# EAGLE design 261003902xxxx-HW-V1.3 (EAGLE 7.7.0)
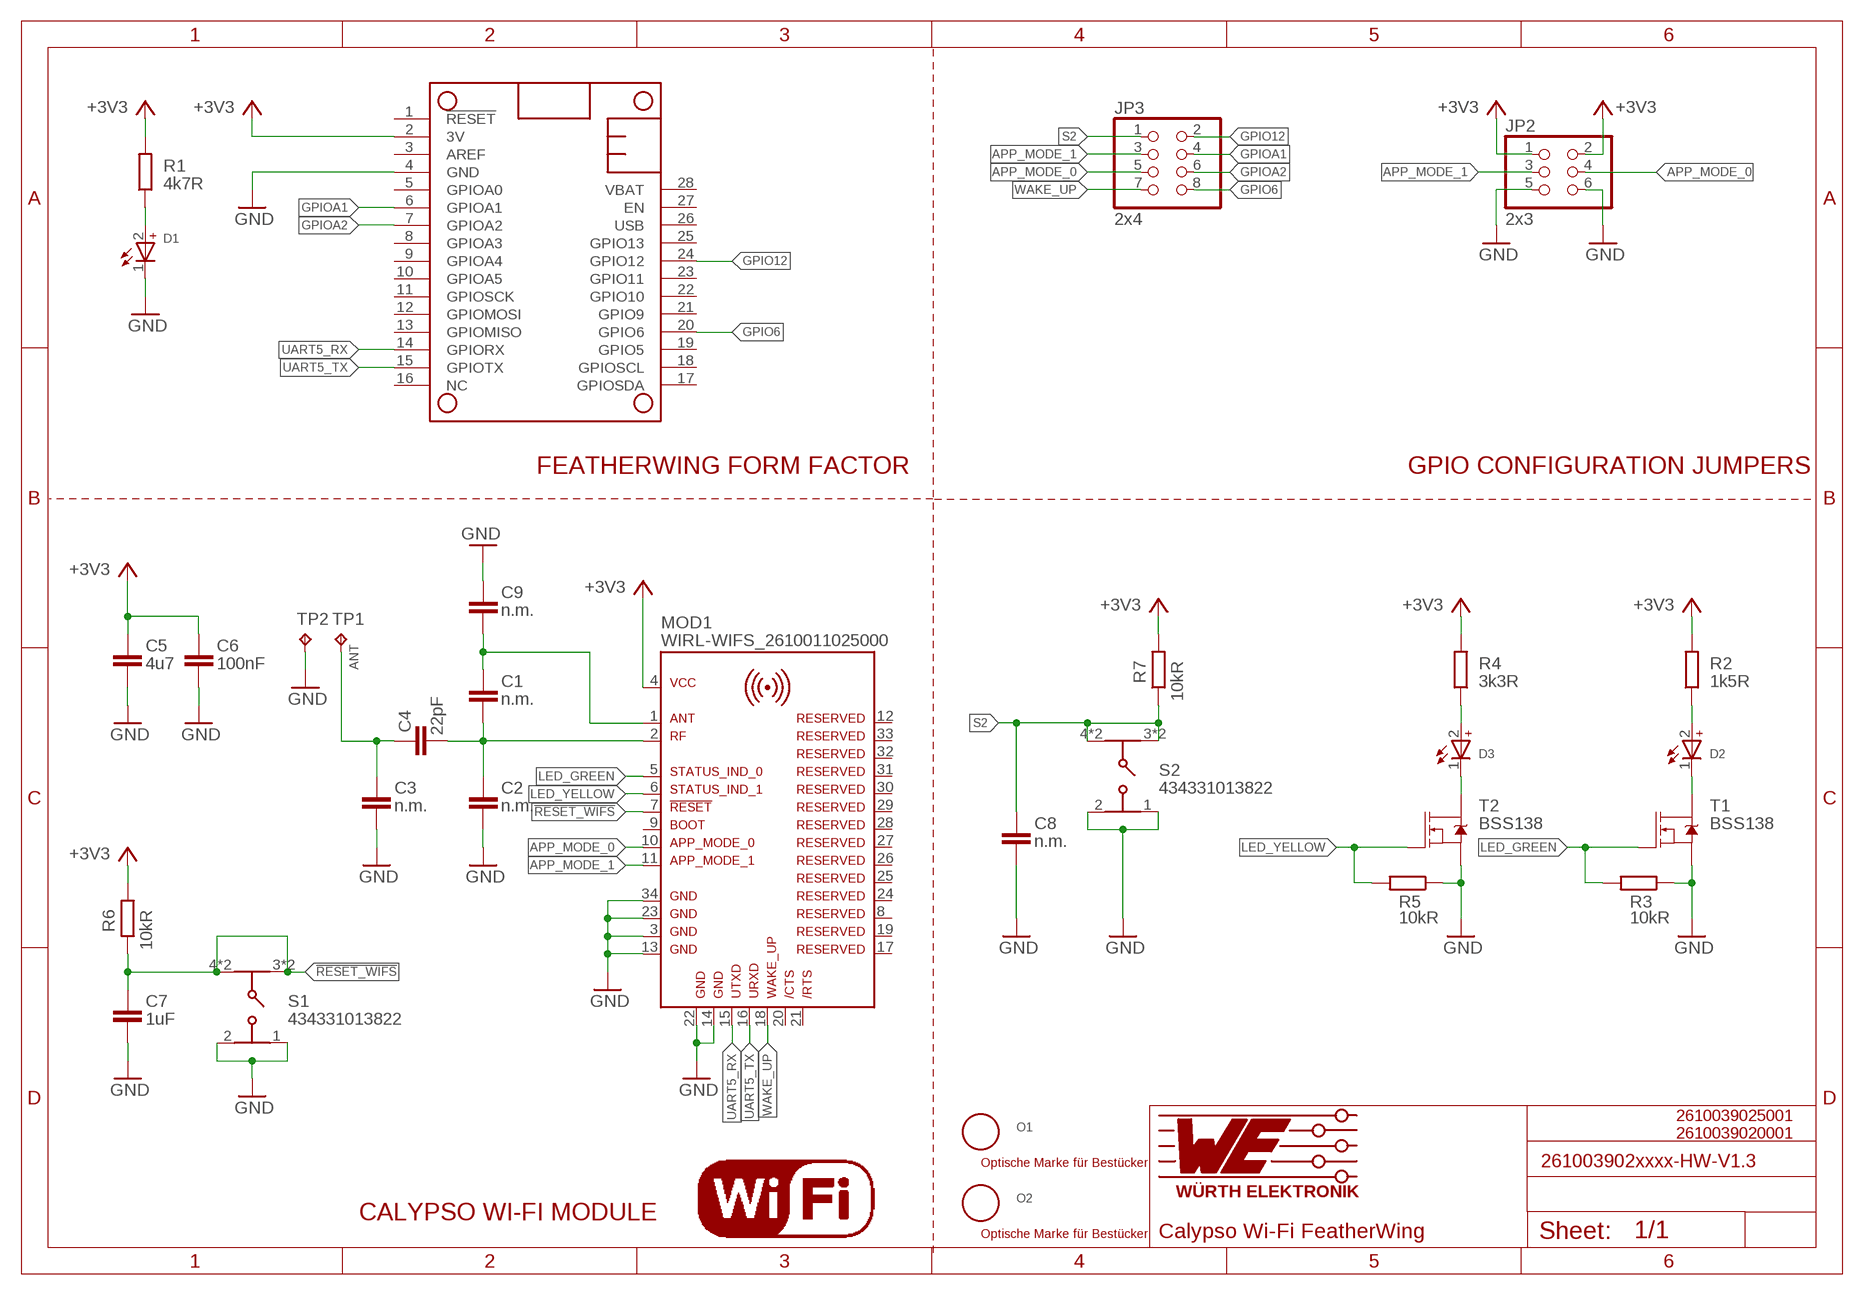
[diagram p0: schematic, sheet 1]

## Parts
C1  n.m.  C0402_IPC  [C0402_IPC]
C2  n.m.  C0201_IPC  [C0201_IPC]
C3  n.m.  C0201_IPC  [C0201_IPC]
C4  22pF  C22PF0402_IPC  [C0402_IPC]
C5  4u7  C4.7UF0402_IPC  [C0402_IPC]
C6  100nF  C100NF0402_IPC  [C0402_IPC]
C7  1uF  C1UF0402_IPC  [C0402_IPC]
C8  n.m.  C0402_IPC  [C0402_IPC]
C9  n.m.  C0201_IPC  [C0201_IPC]
D1  RED  WL-SMSW_1204_155124RS73200  [WL-SMSW_1204_A]
D2  GREEN  WL-SMSW_1204_155124VS73200  [WL-SMSW_1204_A]
D3  YELLOW  WL-SMSW_1204_155124YS73200  [WL-SMSW_1204_A]
JP2  2x3  PINHD-2X3  [2X03]
JP3  2x4  PINHD-2X4  [2X04]
MOD1  WIRL-WIFS_2610011025000  [WIRL-WIFS_2610011025000]
MS1  header: 1 x 12 & 1 x 16  FEATHERWING_80MM  [FEATHERWING_80MM]
O1  n.m.  OPT_MARKE  [OPTISCHE_MARKE]
O2  n.m.  OPT_MARKE  [OPTISCHE_MARKE]
R1  4k7R  R4K70402_IPC  [R0402_IPC]
R2  1k5R  R1K5R0402_IPC  [R0402_IPC]
R3  10kR  R10KR0402_IPC  [R0402_IPC]
R4  3k3R  R3K3R0402_IPC  [R0402_IPC]
R5  10kR  R10KR0402_IPC  [R0402_IPC]
R6  10kR  R10KR0402_IPC  [R0402_IPC]
R7  10kR  R10KR0402_IPC  [R0402_IPC]
S1  434331013822  [434331013822]
S2  434331013822  [434331013822]
T1  BSS138  MOSFET-NCH-BSS138  [SOT23-3]
T2  BSS138  MOSFET-NCH-BSS138  [SOT23-3]
TP1  n.m.  TP-DRILL0.6  [D0.6]
TP2  n.m.  TP-DRILL0.6  [D0.6]
U$1  WIFI5MM  [WIFI_5MM]

## Nets
!RESET_WIFS: C7.1 MOD1.7 R6.1 S1.3 S1.4 S1.5 S1.6
+3V3 [V]: C5.1 C6.1 JP2.1 JP2.2 MOD1.4 MS1.2(3V) R1.2 R2.2 R4.2 R6.2 R7.2
ANT: C3.P$1 C4.1 TP1.P$1(TP)
APP_MODE_0: JP2.4 JP3.5 MOD1.10
APP_MODE_1: JP2.3 JP3.3 MOD1.11
GND: C2.P$2 C3.P$2 C5.2 C6.2 C7.2 C8.2 C9.P$2 D1.1(-) JP2.5 JP2.6 MOD1.3 MOD1.13 MOD1.14 MOD1.22 MOD1.23 MOD1.34 MS1.4(GND) R3.1 R5.1 S1.1 S1.2 S2.1 S2.2 T1.2(S) T2.2(S) TP2.P$1(TP)
GPIO6: JP3.8 MS1.20(GPIO6)
GPIO12: JP3.2 MS1.24(GPIO12)
GPIOA1: JP3.4 MS1.6(GPIOA1)
GPIOA2: JP3.6 MS1.7(GPIOA2)
LED_GREEN: MOD1.5 R3.2 T1.1(G)
LED_YELLOW: MOD1.6 R5.2 T2.1(G)
N$1: D1.2(+) R1.1
N$2: C1.1 C2.P$1 C4.2 MOD1.2
N$3: C1.2 C9.P$1 MOD1.1
N$5: D2.2(+) R2.1
N$6: D2.1(-) T1.3(D)
N$8: D3.2(+) R4.1
N$9: D3.1(-) T2.3(D)
S2: C8.1 JP3.1 R7.1 S2.3 S2.4 S2.5 S2.6
UART5_RX: MOD1.15 MS1.14(GPIORX)
UART5_TX: MOD1.16 MS1.15(GPIOTX)
WAKE_UP: JP3.7 MOD1.18
Unconnected: MOD1.8 MOD1.9 MOD1.12 MOD1.17 MOD1.19 MOD1.20 MOD1.21 MOD1.24 MOD1.25 MOD1.26 MOD1.27 MOD1.28 MOD1.29 MOD1.30 MOD1.31 MOD1.32 MOD1.33 MS1.1(!RESET) MS1.3(AREF) MS1.5(GPIOA0) MS1.8(GPIOA3) MS1.9(GPIOA4) MS1.10(GPIOA5) MS1.11(GPIOSCK) MS1.12(GPIOMOSI) MS1.13(GPIOMISO) MS1.16(NC) MS1.17(GPIOSDA) MS1.18(GPIOSCL) MS1.19(GPIO5) MS1.21(GPIO9) MS1.22(GPIO10) MS1.23(GPIO11) MS1.25(GPIO13) MS1.26(USB) MS1.27(EN) MS1.28(VBAT)

## Notes on the sheet
- FEATHERWING FORM FACTOR | GPIO CONFIGURATION JUMPERS
- 2610039025001
  2610039020001
- CALYPSO WI-FI MODULE
- Calypso Wi-Fi FeatherWing

## Library data of the parts
C1 C8 = rcl-amber:C; HEIGHT: 0.5mm; PACK: 0402
C2 C3 C9 = rcl-amber:C; HEIGHT: 0.3mm; PACK: 0201
C4 = rcl-WE:C; HEIGHT: 0.5mm; MANUFACTURER: Würth Elektronik; MAT: NP0; NR: 885012005057; PACK: 0402; SPG: 50V; TOL: 5%
C5 = rcl-WE:C; HEIGHT: 0.5mm; MANUFACTURER: Würth Elektronik; MAT: X5R; NR: 885012105008; PACK: 0402; SPG: 6.3V; TOL: 20%
C6 = rcl-WE:C; HEIGHT: 0.5mm; MANUFACTURER: Würth Elektronik; MAT: X7R; NR: 885012205037; PACK: 0402; SPG: 16V; TOL: 10%
C7 = rcl-WE:C; HEIGHT: 0.5mm; MANUFACTURER: Würth Elektronik; MAT: X5R; NR: 885012105012; PACK: 0402; SPG: 10V; TOL: 20%
D1 = 155124YS73200A_Eagle_WL-SMSW_rev20a:WL-SMSW_1204: WL-SMSW SMT Mono-color Side View Waterclear Characteristics High reliability Low current requirement No UV/IR radiation Wide viewing angle Excelllent for edge lighting LED displays and backlighting indicators Ideal for miniature applications Compatible with automatic placement equipment Applications Backlighting for LCD Sidelighting applications Indicator and backlighting for telecommunication Backlighting for symbols, switches and dashboards General LED lighting <https://www.we-online.com/catalog/media/o35735v209%20Family_WL-SMSW_1204_155124xx73200A.jpg> Details see: https://www.we-online.com/catalog/en/WL-SMSW/; HEIGHT: 1.5mm; MANUFACTURER: Würth Elektronik; NR: 155124RS73200; PACK: 1204
D2 = 155124YS73200A_Eagle_WL-SMSW_rev20a:WL-SMSW_1204: WL-SMSW SMT Mono-color Side View Waterclear Characteristics High reliability Low current requirement No UV/IR radiation Wide viewing angle Excelllent for edge lighting LED displays and backlighting indicators Ideal for miniature applications Compatible with automatic placement equipment Applications Backlighting for LCD Sidelighting applications Indicator and backlighting for telecommunication Backlighting for symbols, switches and dashboards General LED lighting <https://www.we-online.com/catalog/media/o35735v209%20Family_WL-SMSW_1204_155124xx73200A.jpg> Details see: https://www.we-online.com/catalog/en/WL-SMSW/; HEIGHT: 1.5mm; MANUFACTURER: Würth Elektronik; NR: 155124VS73200; PACK: 1204
D3 = 155124YS73200A_Eagle_WL-SMSW_rev20a:WL-SMSW_1204: WL-SMSW SMT Mono-color Side View Waterclear Characteristics High reliability Low current requirement No UV/IR radiation Wide viewing angle Excelllent for edge lighting LED displays and backlighting indicators Ideal for miniature applications Compatible with automatic placement equipment Applications Backlighting for LCD Sidelighting applications Indicator and backlighting for telecommunication Backlighting for symbols, switches and dashboards General LED lighting <https://www.we-online.com/catalog/media/o35735v209%20Family_WL-SMSW_1204_155124xx73200A.jpg> Details see: https://www.we-online.com/catalog/en/WL-SMSW/; HEIGHT: 1.5mm; MANUFACTURER: Würth Elektronik; NR: 155124YS73200; PACK: 1204
JP2 = pinhead:PINHD-2X3: PIN HEADER; HEIGHT: 8.54mm; MANUFACTURER: Würth Elektronik; NR: 61300621121
JP3 = pinhead:PINHD-2X4: PIN HEADER; HEIGHT: 8.54mm; MANUFACTURER: Würth Elektronik; NR: 61300821121
MOD1 = WE_WIRL_Rev1_mod:WIRL-WIFS_2610011025000: Calypso - Wi-Fi Radio Module WIRL-WIFS Calypso WIFI module T&R Details see: https://katalog.we-online.com/en/wco/Calypso Created By Ella Wu 2019-03-28 2019 (C) Wurth Elektronik; HEIGHT: 3.0mm; MANUFACTURER: Würth Elektronik; NR: 2610011025000
MS1 = adafruit_feather_long:FEATHERWING; COMMENT: Kit containing 2 headers; MANUFACTURER: Adafruit; NR: 2830
O1 O2 = testpad:OPT_MARKE: Gemäß Vorgabe MEC
R1 = rcl-amber:R; HEIGHT: 0.35mm; MANUFACTURER: Yageo; NR: RC0402FR-074K7L; P: 0.063W; PACK: 0402; TOL: 1%
R2 = rcl-amber:R; HEIGHT: 0.35mm; MANUFACTURER: Yageo; NR: RC0402FR-071K5L; PACK: 0402; TOL: 1%
R3 R5-R7 = rcl-amber:R; HEIGHT: 0.35mm; MANUFACTURER: Yageo; NR: RC0402FR-0710KL; PACK: 0402; TOL: 1%
R4 = rcl-amber:R; HEIGHT: 0.35; MANUFACTURER: Yageo; NR: RC0402FR-073K3L; P: 0.063W; PACK: 0402; TOL: 1%
S1 S2 = 434331013822_Eagle_WS-TASU_rev19b:434331013822: WS-TASU Side push Tact Switch, SMD version Specification Rating : 50mA, 12VDC Contact Resistance Initial: 100mΩ max. After life test:1mΩ max. Insulation Resistance: min.100MΩ at 500VDC Dielectric Strength : 250VAC for 1 minute Stroke:0.2+0.2/-0.1mm Bounce :10ms max. Material Cover : : Stainless steel Stem :PA46 UL HB. FramePA46 UL HB, color Black >Contact : Stainless Steel with Silver Tape:Polyimide tape Terminal : Copper Alloy with Silver <http://katalog.we-online.de/media/images/v2/Family_WS-TASU_434331013822_c.jpg> Details see: http://katalog.we-online.de/en/em/TASU_3_5X2_9_SMD_SIDE_PUSH/434331013822 2015 (C) Würth Elektronik; HEIGHT: 1.35mm; MANUFACTURER: Würth Elektronik; NR: 434331013822
T1 T2 = SparkFun-DiscreteSemi:MOSFET-NCH: N-channel MOSFETs Voltage controlled devices that allow control of high current outputs. SparkFun Products: SparkFun OpenScale <https://www.sparkfun.com/products/13261> SparkFun Digital Sandbox <https://www.sparkfun.com/products/12651> SparkFun Monster Moto Shield <https://www.sparkfun.com/products/10182> SparkFun MOSFET Power Controller <https://www.sparkfun.com/products/11214>; HEIGHT: 1mm; MANUFACTURER: Diodes Incorporated; NR: BSS138-13-F; PACK: SOT23-3; PROD_ID: TRANS-00830; VALUE: 220mA/50V/3.5Ω
TP1 TP2 = testpad:TP-DRILL
U$1 = logo:WIFI

## Net classes
1 V: width 0.3 mm

## Board
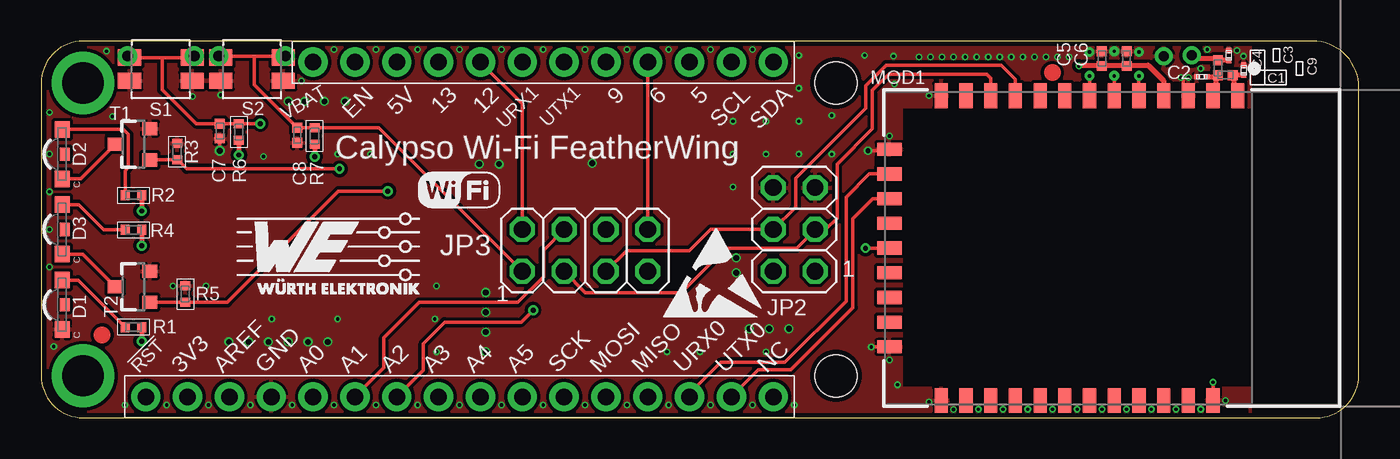
[diagram p1: board, top side]
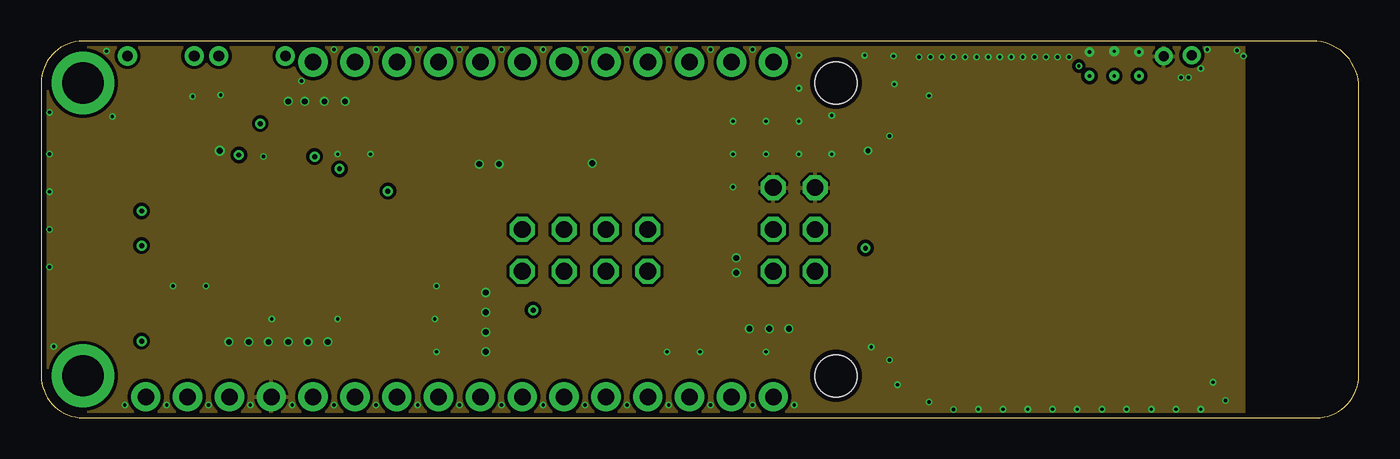
[diagram p2: board, inner layer Route2]
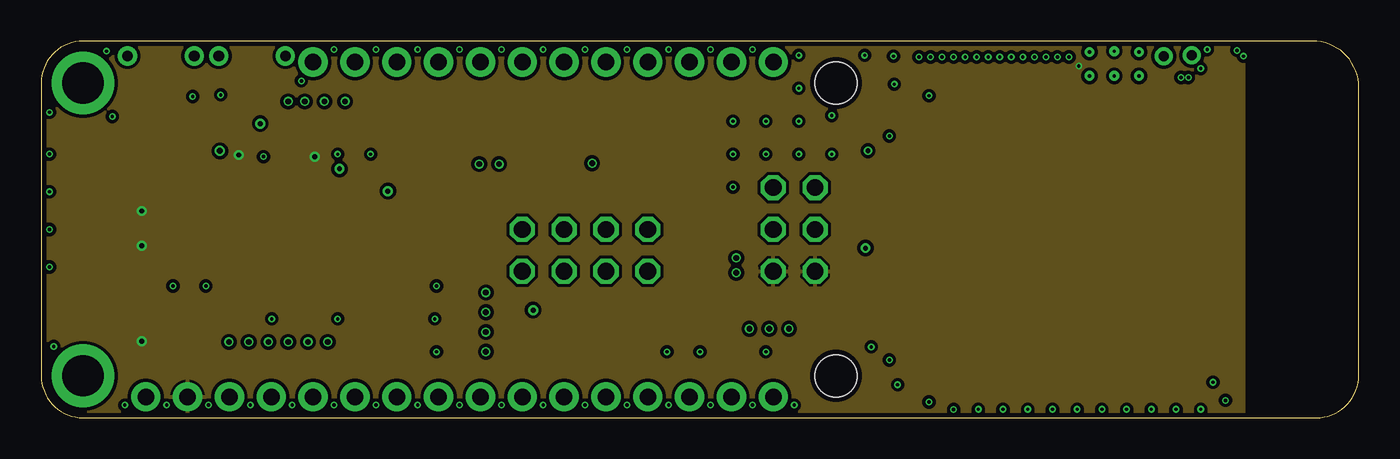
[diagram p3: board, inner layer Route15]
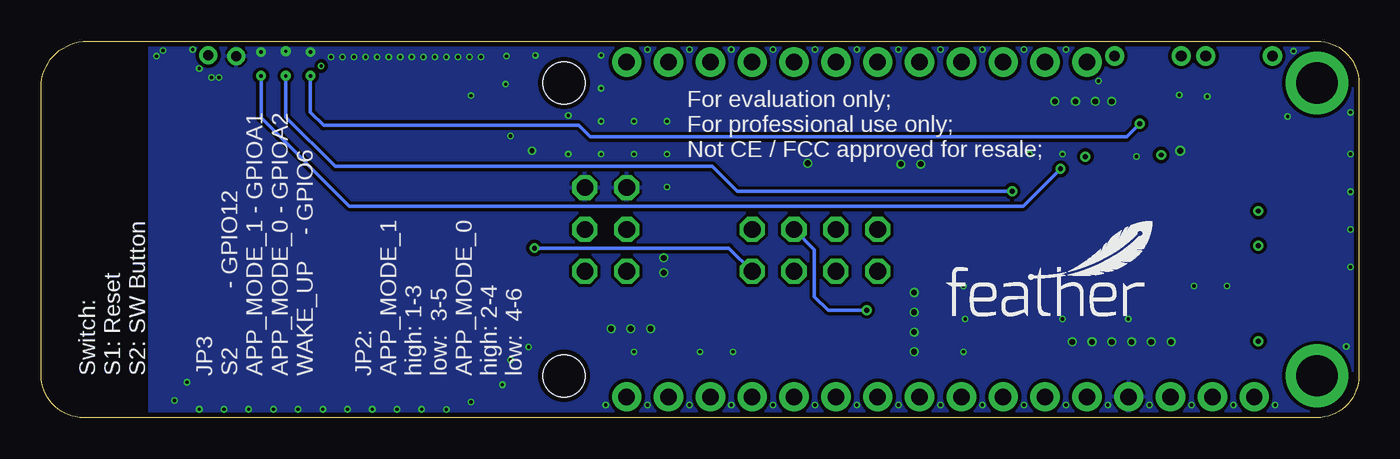
[diagram p4: board, bottom side, seen from below]

Size 80 x 22.86 mm. Coordinates in mm from the lower left corner, seen from the top.
Copper layers (1+2*15+16): Top 0.035mm / dielectric 0.376mm / Route2 0.035mm / dielectric 0.71mm / Route15 0.035mm / dielectric 0.376mm / Bottom 0.035mm
Design rules "default *": minimum track width 0.2mm, minimum drill 0.2mm, track to track 0.2mm, track to pad 0.2mm, pad to pad 0.2mm, via to via 0.2mm, smd to smd 0.2mm, copper to edge 0.3mm, drill to drill 6mil, minimum pad ring 10mil, minimum via ring 0.1mm, stop-mask expansion 0.05mm, vias tented up to drill 20mil, thermal gap 6mil
tRestrict: area 71.7,0.3 to 73.3,0.7; area 70.2,0.8 to 70.7,2; area 70.7,1.8 to 70.9,2.3; area 70.8,2.4 to 71.5,2.6; area 71.4,1.8 to 71.7,2.4; area 52.3,1.9 to 73.4,18.8; area 68.6,18.8 to 69.2,20.4; area 70.1,18.8 to 70.7,20.3; area 50.6,15.2 to 52.2,15.9; area 55.1,18.8 to 55.7,20.5; area 59.6,20.4 to 63.2,20.4; area 64.1,20.3 to 64.7,20.4; area 65.7,20.3 to 66.2,20.4; area 68.7,0.8 to 69.2,2; area 67.2,0.8 to 67.7,2; area 65.7,0.8 to 66.2,2; area 64.2,0.8 to 64.7,2; area 62.6,0.8 to 63.1,2; area 61.1,0.8 to 61.6,2; area 59.6,0.8 to 60.1,2; area 58.1,0.8 to 58.6,2; area 56.6,0.8 to 57.1,2; area 55.1,0.8 to 55.6,2

### Footprints (pad centres in the part's own frame; a part is rotated, then mirrored left to right if it is on the bottom)
C0402_IPC = smd 0.6 x 0.6: 1 -0.45,0; 2 0.45,0
C0201_IPC = smd 0.35 x 0.3: P$1 -0.3,0; P$2 0.3,0
WL-SMSW_1204_A = smd 1 x 0.9: 1 -1.5,0; 2 1.5,0 | smd 0.8 x 0.6: 3 0,-0.15
2X03 = drill 1.016 octagon: 1 -2.54,-1.27; 2 -2.54,1.27; 3 0,-1.27; 4 0,1.27; 5 2.54,-1.27; 6 2.54,1.27
2X04 = drill 1.016 octagon: 1 -3.81,-1.27; 2 -3.81,1.27; 3 -1.27,-1.27; 4 -1.27,1.27; 5 1.27,-1.27; 6 1.27,1.27; 7 3.81,-1.27; 8 3.81,1.27
WIRL-WIFS_2610011025000 = smd 0.8 x 1.5: 1 -7.65,-9.25; 2 -6.15,-9.25; 3 -4.65,-9.25; 4 -3.15,-9.25; 5 -1.65,-9.25; 6 -0.15,-9.25; 7 1.35,-9.25; 8 2.85,-9.25; 9 4.35,-9.25; 10 5.85,-9.25; 11 7.35,-9.25; 12 8.85,-9.25; 13 10.35,-9.25; 23 10.35,9.25; 24 8.85,9.25; 25 7.35,9.25; 26 5.85,9.25; 27 4.35,9.25; 28 2.85,9.25; 29 1.35,9.25; 30 -0.15,9.25; 31 -1.65,9.25; 32 -3.15,9.25; 33 -4.65,9.25; 34 -6.15,9.25 | smd 1.5 x 0.8: 14 13.5,-6; 15 13.5,-4.5; 16 13.5,-3; 17 13.5,-1.5; 18 13.5,0; 19 13.5,1.5; 20 13.5,3; 21 13.5,4.5; 22 13.5,6
FEATHERWING_80MM = drill 1 pad 1.778: 1 6.35,1.27; 2 8.89,1.27; 3 11.43,1.27; 4 13.97,1.27; 5 16.51,1.27; 6 19.05,1.27; 7 21.59,1.27; 8 24.13,1.27; 9 26.67,1.27; 10 29.21,1.27; 11 31.75,1.27; 12 34.29,1.27; 13 36.83,1.27; 14 39.37,1.27; 15 41.91,1.27; 16 44.45,1.27; 17 44.45,21.59; 18 41.91,21.59; 19 39.37,21.59; 20 36.83,21.59; 21 34.29,21.59; 22 31.75,21.59; 23 29.21,21.59; 24 26.67,21.59; 25 24.13,21.59; 26 21.59,21.59; 27 19.05,21.59; 28 16.51,21.59 | drill 2.5 pad 3.81: P$1 2.54,20.32; P$2 2.54,2.54 | hole 2.54: 48.26,20.32; 48.26,2.54
R0402_IPC = smd 0.55 x 0.6: 1 -0.5,0; 2 0.5,0
434331013822 = smd 1.4 x 1: 1 -1.9,0.7; 2 1.9,0.7; 3 1.9,-0.7; 4 -1.9,-0.7 | drill 0.65 pad 0.78: 5 -2.025,-0.8; 6 2.025,-0.8
SOT23-3 = smd 0.8 x 0.9: 1 -0.95,-1; 2 0.95,-1; 3 0,1.1
D0.6 = drill 0.6: P$1 0,0

### Placement (x,y rotation side)
C1  71.9,20.8 0 top
C2  70.47,20.7 180 top
C3  72.1,22 90 top
C4  71.45,21.25 270 top
C5  64.4,21.8 90 top
C6  65.9,21.8 90 top
C7  10.85,17.4 270 top
C8  15.55,17.15 270 top
C9  73,21.1 90 top
D1  1.27,6.86 90 top
D2  1.27,16 90 top
D3  1.27,11.43 90 top
JP2  45.72,11.43 90 top
JP3  33.02,10.16 0 top
MOD1  65,10.3 180 top
MS1  0,0 0 top
O1  61.4,20.95 0 top
O2  3.7,5.02 0 top
R1  5.6,5.5 0 top
R2  5.6,13.5 0 top
R3  8.25,16.15 270 top
R4  5.6,11.4 0 top
R5  8.75,7.5 270 top
R6  12,17.35 270 top
R7  16.6,17.1 270 top
S1  7.26,21.16 180 top
S2  12.8,21.16 180 top
T1  5.6,16.6 90 top
T2  5.6,7.95 90 top
TP1  69.85,22 0 top
TP2  68.15,21.95 0 top
U$1  22.86,12.7 0 top
U$2  [WE-LOGO-5MM_TNAME]  17.42,9.98 0 top
U$4  [FEATHER_12MM]  25.05,6.15 0 bottom
U$5  [ESD_6MM]  37.7,6.05 0 top

### Tracks (layer width: path | path; a pad name or v marks a point on that pad's centre or on a via)
!RESET_WIFS  (via drill 0.2 pad 0.6, 0.3 pad 0.6)
  Top 0.2: v63.65,20.75 MOD1.7 63.65,19.5 | S1.3 5.34,21.86 S1.6 5.26,21.96 S1.3 | S1.3 7.4,21.86 | 7.4,21.86 S1.4 9.19,21.86 S1.5 | 7.4,21.86 7.35,21.81 7.35,19.9 9.4,17.85 C7.1 R6.1 v13.3,17.85
  Bottom 0.2: v63.65,20.75 63.65,18.55 62.85,17.75 47.35,17.75 46.65,17.05 14.1,17.05 v13.3,17.85
+3V3  (via drill 0.2 pad 0.3, 0.3 pad 0.6)
  Top 0.3: v63,21.35 63.05,21.4 64.35,21.4 C5.1 64.45,21.4 65.85,21.4 C6.1 65.95,21.4 67.2,21.4 68.15,20.45 MOD1.4 | R4.2 v6.1,10.45 | R2.2 v6.1,12.55 | R6.2 v12,15.95 | R1.2 v6.1,4.65 | R7.2 v16.6,15.85
  pour Route15: 0,0 0,22.86 80.01,22.86 80.01,0
ANT
  Top 0.3: C3.P$1 C4.1 71.35,21.8 70.05,21.8 TP1.P$1
APP_MODE_0
  Top 0.2: MOD1.10 59.15,20.55 58.3,21.4 51.3,21.4 50.05,20.15 50.05,18.8 45.8,14.55 45.8,12.78 JP2.4 40.64,11.43 39.36,10.15 35.55,10.15 JP3.5
APP_MODE_1
  Top 0.2: MOD1.11 57.65,20.6 57.4,20.85 51.45,20.85 50.47,19.87 50.47,17.53 48.32,15.38 48.32,12.12 47.63,11.43 JP2.3 45.86,10.3 41.55,10.3 38.85,7.6 33.04,7.6 JP3.3
GND  (via drill 0.2, 0.2 pad 0.2, 0.2 pad 0.4, 0.2 pad 0.6, 0.3, 0.35, 0.35 pad 0.6)
  Top 0.2: C7.2 v10.85,16.2 | v69.2,20.65 69.2,20.6 69.35,20.45 69.35,19.55 MOD1.3 | MOD1.34 v71.15,2.15 | MOD1.14 51.5,16.25 51.45,16.2 v50.2,16.2 | MOD1.22 v50.4,4.3
  other vias: 15,19.2 16,19.2 17.2,19.2 18.45,19.2 26.6,15.4 27.8,15.4 33.45,15.45 43,5.4 44.2,5.4 45.4,5.4 17.4,4.6 16.2,4.6 15,4.6 13.8,4.6 12.6,4.6 11.4,4.6 27,7.6 27,6.4 27,5.2 27,4 42.2,8.8 42.2,9.7 70.4,21.2 69.65,20.65 63.65,22.2 62.4,21.9 61.7,21.9 61,21.9 60.3,21.9 59.6,21.9 58.9,21.9 58.2,21.9 57.5,21.9 56.8,21.9 56.1,21.9 55.4,21.9 54.7,21.9 54,21.9 53.3,21.9 51.75,21.95 53.9,19.55 51.8,20.25 70.8,22.35 73,21.95 72.6,22.3 71.9,1.05 51.5,3.5 53.9,0.95 46,22 50,22 46,20 44,18 42,18 46,18 48,18.35 48,16 46,16 44,16 42,16 43.18,22.35 40.64,22.35 38.1,22.35 35.56,22.35 33.02,22.35 30.48,22.35 27.94,22.35 25.4,22.35 22.86,22.35 20.32,22.35 17.78,22.35 7.62,0.76 10.16,0.76 12.7,0.76 15.24,0.76 17.78,0.76 20.32,0.76 22.86,0.76 25.4,0.76 27.94,0.76 30.48,0.76 33.02,0.76 35.56,0.76 38.1,0.76 40.64,0.76 43.18,0.76 45.72,0.76 5.08,0.76 0.76,4.32 0.51,9.14 0.51,11.43 0.51,13.72 0.51,16 0.51,18.54 3.97,22.25 4.32,18.29 51.5,17.1 66.65,22.2 55.4,0.5 56.9,0.51 58.4,0.51 59.9,0.51 61.4,0.51 62.9,0.51 64.4,0.51 65.9,0.51 67.4,0.51 68.9,0.51 70.4,0.51 42,14 44,4 40,4 38,4 52,2 23.9,6 24,8 24,4 18,6 14,6 10,8 8,8 18,16 20,16 13.5,15.85 15.8,20.45 10.9,19.6 9.2,19.5 65.15,22.25
  pour Top: 0,19.05 0,20.32 arc-90 2.54,22.86 77.2,22.86 arc-90 80.01,20.05 80.01,2.6 arc-90 77.41,0 2.59,0 arc-90 0,2.59
  pour Bottom: 80.01,20.05 80.01,2.6 arc-90 77.41,0 2.59,0 arc-90 0,2.59 0,20.27 arc-90 2.59,22.86 77.2,22.86 arc-90
  pour Route2: 0,0 0,22.86 80.01,22.86 80.01,0
GPIO6
  Top 0.2: MS1.20 JP3.8
GPIO12
  Top 0.2: MS1.24 29.21,19.05 JP3.2
GPIOA1
  Top 0.2: MS1.6 20.8,3.02 20.8,4.85 22.95,7 28.95,7 30.5,8.55 30.5,10.18 JP3.4
GPIOA2  (via drill 0.3 pad 0.6)
  Top 0.2: MS1.7 23.2,2.88 23.2,4.5 24.5,5.8 29.15,5.8 v29.88,6.53
  Bottom 0.2: JP3.6 33.05,10.19 33.05,7.35 32.23,6.53 v29.88,6.53
LED_GREEN  (via drill 0.2 pad 0.6, 0.3 pad 0.6)
  Top 0.2: v18.11,15.11 8.84,15.11 8.3,15.65 R3.2 T1.1 | v66.65,20.75 MOD1.5
  Bottom 0.2: v66.65,20.75 66.65,18.2 61.3,12.85 20.37,12.85 v18.11,15.11
LED_YELLOW  (via drill 0.2 pad 0.6, 0.3 pad 0.6)
  Top 0.2: v65.15,20.75 MOD1.6 | T2.1 R5.2 11.3,7 18.05,13.75 v21.05,13.75
  Bottom 0.2: v65.15,20.75 65.15,18.25 62.16,15.26 39.26,15.26 37.75,13.75 v21.05,13.75
N$1
  Top 0.2: D1.2 2.24,8.36 R1.1
N$2
  Top 0.3: C2.P$1 71.35,20.7 | 71.35,20.7 C4.2 71.4,20.75 | MOD1.2 71.35,19.75 71.35,20.7
N$3
  Top 0.3: MOD1.1 72.45,19.75 72.45,20.7 C1.2 C9.P$1
N$5
  Top 0.2: D2.2 5,17.5 5.3,17.2 5.3,15.2 5.1,15 R2.1
N$6
  Top 0.2: T1.3 2.4,14.5 D2.1
N$8
  Top 0.2: R4.1 3.8,11.4 2.27,12.93 D3.2
N$9
  Top 0.2: D3.1 2.52,9.93 T2.3
N$10
  cutout Route2: 73.2,23.2 73.2,-0.2 78.6,-0.2 80.2,1.4 80.2,20.6 80.2,21.2 78.2,23.2
  cutout Route15: 73.2,23.2 73.2,-0.2 78.6,-0.2 80.2,1.4 80.2,21.19 78.19,23.2
S2
  Top 0.2: S2.3 10.8,21.96 S2.6 12.95,21.96 | 12.95,21.96 S2.5 14.73,21.86 S2.4 | 12.95,21.96 12.95,20.2 C8.1 R7.1 20.5,17.6 JP3.1
UART5_RX
  Top 0.2: MS1.14 39.37,1.47 41.26,3.35 45.15,3.35 48.87,7.07 48.87,13.38 50.29,14.8 MOD1.15
UART5_TX
  Top 0.2: MS1.15 43.54,2.9 45.5,2.9 49.28,6.68 49.28,12.08 50.5,13.3 MOD1.16
WAKE_UP  (via drill 0.3 pad 0.6)
  Top 0.2: MOD1.18 v50.05,10.3
  Bottom 0.2: v50.05,10.3 38.24,10.3 JP3.7

### Text on the board
tNames: VBAT | EN | 5V | 13 | 12 | URX1 | UTX1 | 9 | 6 | 5 | SCL | SDA | Calypso Wi-Fi FeatherWing | 1 | 1 | !RST | 3V3 | AREF | GND | A0 | A1 | A2 | A3 | A4 | A5 | SCK | MOSI | MISO | URX0 | UTX0 | NC
bNames: For evaluation only; / For professional use only; / Not CE / FCC approved for resale; | JP2: / APP_MODE_1 / high: 1-3 / low: 3-5 / APP_MODE_0 / high: 2-4 / low: 4-6 | JP3 / S2 - GPIO12 / APP_MODE_1 - GPIOA1 / APP_MODE_0 - GPIOA2 / WAKE_UP - GPIO6 | Switch: / S1: Reset / S2: SW Button